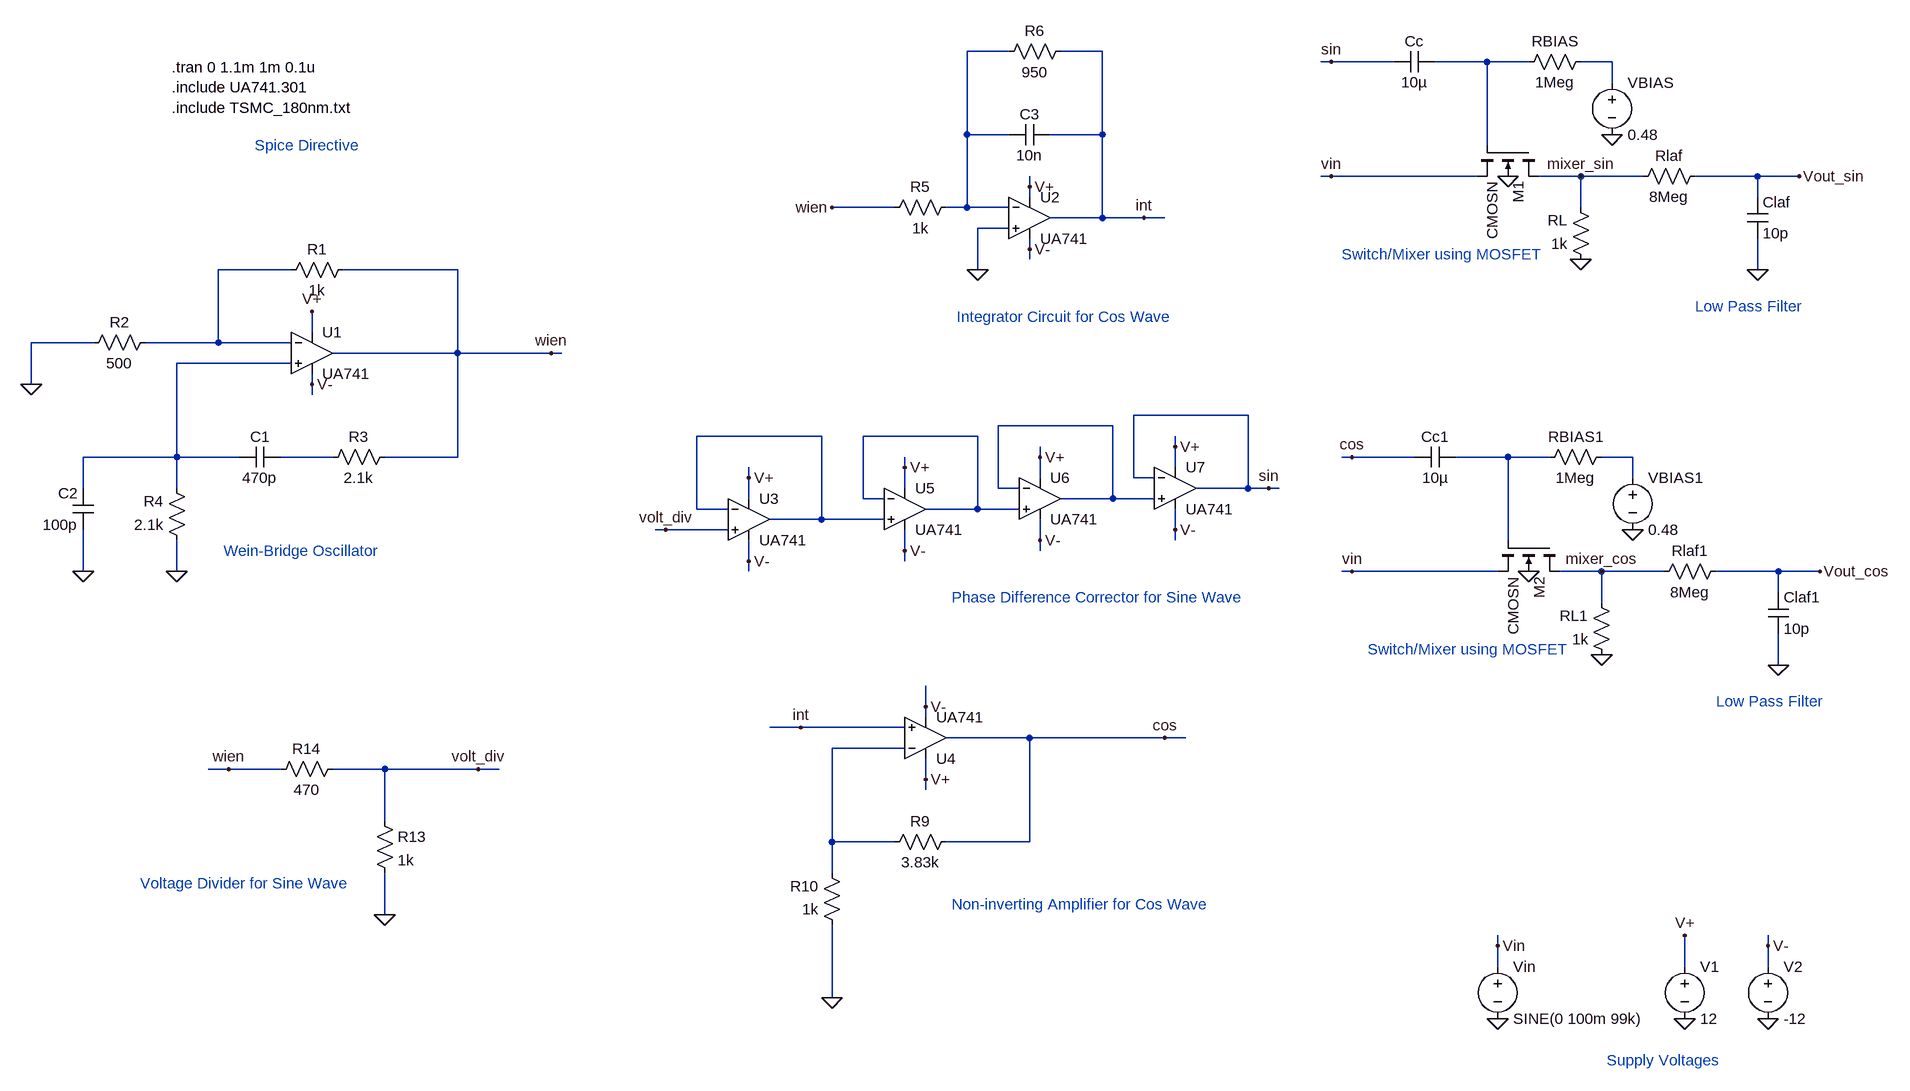
[diagram p0: schematic notfinal111.asc]
notfinal111.asc, the LTspice schematic file:
Version 4
SHEET 1 4804 1592
WIRE -400 -64 -464 -64
WIRE -256 -64 -320 -64
WIRE 96 -48 80 -48
WIRE 192 -48 96 -48
WIRE 336 -48 256 -48
WIRE 400 -48 336 -48
WIRE 528 -48 480 -48
WIRE 528 -16 528 -48
WIRE -464 64 -464 -64
WIRE -400 64 -464 64
WIRE -256 64 -256 -64
WIRE -256 64 -336 64
WIRE 336 80 336 -48
WIRE 96 128 80 128
WIRE 320 128 96 128
WIRE 480 128 416 128
WIRE 576 128 480 128
WIRE 752 128 656 128
WIRE 816 128 752 128
WIRE -368 144 -368 128
WIRE -368 160 -368 144
WIRE 752 160 752 128
WIRE -576 176 -672 176
WIRE -464 176 -464 64
WIRE -464 176 -496 176
WIRE -400 176 -464 176
WIRE 480 176 480 128
WIRE -256 192 -256 64
WIRE -256 192 -336 192
WIRE -192 192 -256 192
WIRE -160 192 -192 192
WIRE -400 208 -448 208
WIRE -368 240 -368 224
WIRE -368 256 -368 240
WIRE -1504 272 -1616 272
WIRE -1248 272 -1424 272
WIRE -448 272 -448 208
WIRE 752 272 752 224
WIRE -1472 368 -1472 336
WIRE -1808 384 -1904 384
WIRE -1616 384 -1616 272
WIRE -1616 384 -1728 384
WIRE -1504 384 -1616 384
WIRE -1248 400 -1248 272
WIRE -1248 400 -1440 400
WIRE -1104 400 -1248 400
WIRE -1088 400 -1104 400
WIRE -1504 416 -1680 416
WIRE -1904 448 -1904 384
WIRE -1472 448 -1472 432
WIRE -1472 464 -1472 448
WIRE -32 496 -208 496
WIRE -240 512 -416 512
WIRE -688 528 -880 528
WIRE -448 528 -624 528
WIRE -144 544 -144 528
WIRE -1680 560 -1680 416
WIRE -1680 560 -1824 560
WIRE -1584 560 -1680 560
WIRE -1440 560 -1520 560
WIRE -1248 560 -1248 400
WIRE -1248 560 -1360 560
WIRE -352 560 -352 544
WIRE 128 560 112 560
WIRE 224 560 128 560
WIRE 368 560 288 560
WIRE 432 560 368 560
WIRE 560 560 512 560
WIRE -560 576 -560 560
WIRE -144 576 -144 544
WIRE -800 592 -800 576
WIRE -352 592 -352 560
WIRE -208 592 -208 496
WIRE -176 592 -208 592
WIRE 560 592 560 560
WIRE -1824 608 -1824 560
WIRE -1680 608 -1680 560
WIRE -560 608 -560 576
WIRE -416 608 -416 512
WIRE -384 608 -416 608
WIRE -32 608 -32 496
WIRE -32 608 -112 608
WIRE 0 608 -32 608
WIRE 16 608 0 608
WIRE -800 624 -800 592
WIRE -624 624 -624 528
WIRE -592 624 -624 624
WIRE -240 624 -240 512
WIRE -240 624 -320 624
WIRE -176 624 -240 624
WIRE -880 640 -880 528
WIRE -832 640 -880 640
WIRE -448 640 -448 528
WIRE -448 640 -528 640
WIRE -384 640 -448 640
WIRE -688 656 -688 528
WIRE -688 656 -768 656
WIRE -592 656 -688 656
WIRE -928 672 -944 672
WIRE -832 672 -928 672
WIRE -144 672 -144 640
WIRE -352 688 -352 656
WIRE -144 688 -144 672
WIRE 368 688 368 560
WIRE -560 704 -560 672
WIRE -352 704 -352 688
WIRE -800 720 -800 688
WIRE -560 720 -560 704
WIRE -1824 736 -1824 672
WIRE -1680 736 -1680 688
WIRE -800 736 -800 720
WIRE 128 736 112 736
WIRE 352 736 128 736
WIRE 512 736 448 736
WIRE 608 736 512 736
WIRE 784 736 688 736
WIRE 848 736 784 736
WIRE 784 768 784 736
WIRE 512 784 512 736
WIRE 784 880 784 832
WIRE -528 944 -528 912
WIRE -528 960 -528 944
WIRE -720 976 -768 976
WIRE -560 976 -720 976
WIRE -368 992 -496 992
WIRE -160 992 -368 992
WIRE -128 992 -160 992
WIRE -560 1008 -672 1008
WIRE -1600 1040 -1632 1040
WIRE -1520 1040 -1600 1040
WIRE -1360 1040 -1440 1040
WIRE -1216 1040 -1360 1040
WIRE -1184 1040 -1216 1040
WIRE -528 1056 -528 1024
WIRE -528 1072 -528 1056
WIRE -1360 1120 -1360 1040
WIRE -672 1152 -672 1008
WIRE -576 1152 -672 1152
WIRE -368 1152 -368 992
WIRE -368 1152 -496 1152
WIRE -672 1200 -672 1152
WIRE -1360 1264 -1360 1200
WIRE 352 1312 352 1296
WIRE 768 1312 768 1296
WIRE 352 1344 352 1312
WIRE 640 1344 640 1296
WIRE 768 1344 768 1312
WIRE -672 1392 -672 1280
FLAG 528 64 0
FLAG 352 1424 0
FLAG 368 128 0
FLAG 480 256 0
FLAG 752 272 0
FLAG 816 128 Vout_sin
FLAG -1904 448 0
FLAG -1824 736 0
FLAG -1680 736 0
FLAG 768 1424 0
FLAG 640 1424 0
FLAG -1472 336 V+
FLAG -1472 448 V-
FLAG 640 1296 V+
FLAG 768 1312 V-
FLAG -1104 400 wien
FLAG -448 272 0
FLAG -672 176 wien
FLAG -368 144 V+
FLAG -368 240 V-
FLAG -192 192 int
FLAG 96 -48 sin
FLAG -672 1392 0
FLAG -720 976 int
FLAG -528 944 V-
FLAG -528 1056 V+
FLAG -1360 1264 0
FLAG -1600 1040 wien
FLAG -1216 1040 volt_div
FLAG -160 992 cos
FLAG 480 128 mixer_sin
FLAG -560 576 V+
FLAG -560 704 V-
FLAG -800 592 V+
FLAG -800 720 V-
FLAG -928 672 volt_div
FLAG -352 560 V+
FLAG -352 688 V-
FLAG -144 544 V+
FLAG -144 672 V-
FLAG 0 608 sin
FLAG 352 1312 Vin
FLAG 96 128 vin
FLAG 560 672 0
FLAG 400 736 0
FLAG 512 864 0
FLAG 784 880 0
FLAG 848 736 Vout_cos
FLAG 128 560 cos
FLAG 512 736 mixer_cos
FLAG 128 736 vin
SYMBOL voltage 528 -32 R0
SYMATTR InstName VBIAS
SYMATTR Value 0.48
SYMBOL voltage 352 1328 R0
SYMATTR InstName Vin
SYMATTR Value SINE(0 100m 99k)
SYMBOL nmos4 416 80 R90
SYMATTR InstName M1
SYMATTR Value2 l=0.18u w=0.4u ad=0.18p as=0.18p pd=1.7u ps=1.7u
SYMATTR Value CMOSN
SYMBOL res 496 -64 R90
WINDOW 0 0 56 VBottom 2
WINDOW 3 32 56 VTop 2
SYMATTR InstName RBIAS
SYMATTR Value 1Meg
SYMBOL res 496 272 R180
WINDOW 0 36 76 Left 2
WINDOW 3 36 40 Left 2
SYMATTR InstName RL
SYMATTR Value 1k
SYMBOL cap 256 -64 R90
WINDOW 0 0 32 VBottom 2
WINDOW 3 32 32 VTop 2
SYMATTR InstName Cc
SYMATTR Value 10µ
SYMBOL res 672 112 R90
WINDOW 0 0 56 VBottom 2
WINDOW 3 32 56 VTop 2
SYMATTR InstName Rlaf
SYMATTR Value 8Meg
SYMBOL cap 736 160 R0
SYMATTR InstName Claf
SYMATTR Value 10p
SYMBOL OpAmps/opamp2 -1472 336 R0
SYMATTR InstName U1
SYMATTR Value UA741
SYMBOL res -1408 256 R90
WINDOW 0 0 56 VBottom 2
WINDOW 3 32 56 VTop 2
SYMATTR InstName R1
SYMATTR Value 1k
SYMBOL res -1712 368 R90
WINDOW 0 0 56 VBottom 2
WINDOW 3 32 56 VTop 2
SYMATTR InstName R2
SYMATTR Value 500
SYMBOL res -1344 544 R90
WINDOW 0 0 56 VBottom 2
WINDOW 3 32 56 VTop 2
SYMATTR InstName R3
SYMATTR Value 2.1k
SYMBOL res -1664 704 R180
WINDOW 0 36 76 Left 2
WINDOW 3 36 40 Left 2
SYMATTR InstName R4
SYMATTR Value 2.1k
SYMBOL cap -1520 544 R90
WINDOW 0 0 32 VBottom 2
WINDOW 3 32 32 VTop 2
SYMATTR InstName C1
SYMATTR Value 470p
SYMBOL cap -1808 672 R180
WINDOW 0 24 56 Left 2
WINDOW 3 24 8 Left 2
SYMATTR InstName C2
SYMATTR Value 100p
SYMBOL voltage 640 1328 R0
SYMATTR InstName V1
SYMATTR Value 12
SYMBOL voltage 768 1328 R0
SYMATTR InstName V2
SYMATTR Value -12
SYMBOL OpAmps/opamp2 -368 128 R0
SYMATTR InstName U2
SYMATTR Value UA741
SYMBOL res -480 160 R90
WINDOW 0 0 56 VBottom 2
WINDOW 3 32 56 VTop 2
SYMATTR InstName R5
SYMATTR Value 1k
SYMBOL cap -336 48 R90
WINDOW 0 0 32 VBottom 2
WINDOW 3 32 32 VTop 2
SYMATTR InstName C3
SYMATTR Value 10n
SYMBOL res -304 -80 R90
WINDOW 0 0 56 VBottom 2
WINDOW 3 32 56 VTop 2
SYMATTR InstName R6
SYMATTR Value 950
SYMBOL OpAmps/opamp2 -528 1056 M180
SYMATTR InstName U4
SYMATTR Value UA741
SYMBOL res -480 1136 R90
WINDOW 0 0 56 VBottom 2
WINDOW 3 32 56 VTop 2
SYMATTR InstName R9
SYMATTR Value 3.83k
SYMBOL res -656 1296 R180
WINDOW 0 36 76 Left 2
WINDOW 3 36 40 Left 2
SYMATTR InstName R10
SYMATTR Value 1k
SYMBOL res -1376 1104 R0
SYMATTR InstName R13
SYMATTR Value 1k
SYMBOL res -1424 1024 R90
WINDOW 0 0 56 VBottom 2
WINDOW 3 32 56 VTop 2
SYMATTR InstName R14
SYMATTR Value 470
SYMBOL OpAmps/opamp2 -800 592 R0
SYMATTR InstName U3
SYMATTR Value UA741
SYMBOL OpAmps/opamp2 -560 576 R0
SYMATTR InstName U5
SYMATTR Value UA741
SYMBOL OpAmps/opamp2 -352 560 R0
SYMATTR InstName U6
SYMATTR Value UA741
SYMBOL OpAmps/opamp2 -144 544 R0
SYMATTR InstName U7
SYMATTR Value UA741
SYMBOL voltage 560 576 R0
SYMATTR InstName VBIAS1
SYMATTR Value 0.48
SYMBOL nmos4 448 688 R90
SYMATTR InstName M2
SYMATTR Value2 l=0.18u w=0.4u ad=0.18p as=0.18p pd=1.7u ps=1.7u
SYMATTR Value CMOSN
SYMBOL res 528 544 R90
WINDOW 0 0 56 VBottom 2
WINDOW 3 32 56 VTop 2
SYMATTR InstName RBIAS1
SYMATTR Value 1Meg
SYMBOL res 528 880 R180
WINDOW 0 36 76 Left 2
WINDOW 3 36 40 Left 2
SYMATTR InstName RL1
SYMATTR Value 1k
SYMBOL cap 288 544 R90
WINDOW 0 0 32 VBottom 2
WINDOW 3 32 32 VTop 2
SYMATTR InstName Cc1
SYMATTR Value 10µ
SYMBOL res 704 720 R90
WINDOW 0 0 56 VBottom 2
WINDOW 3 32 56 VTop 2
SYMATTR InstName Rlaf1
SYMATTR Value 8Meg
SYMBOL cap 768 768 R0
SYMATTR InstName Claf1
SYMATTR Value 10p
TEXT -1688 -40 Left 2 !.tran 0 1.1m 1m 0.1u\n.include UA741.301\n.include TSMC_180nm.txt
TEXT -1608 704 Left 2 ;Wein-Bridge Oscillator
TEXT -480 344 Left 2 ;Integrator Circuit for Cos Wave
TEXT -488 1248 Left 2 ;Non-inverting Amplifier for Cos Wave
TEXT 112 248 Left 2 ;Switch/Mixer using MOSFET
TEXT 656 328 Left 2 ;Low Pass Filter
TEXT 520 1488 Left 2 ;Supply Voltages
TEXT -1736 1216 Left 2 ;Voltage Divider for Sine Wave
TEXT -488 776 Left 2 ;Phase Difference Corrector for Sine Wave
TEXT 152 856 Left 2 ;Switch/Mixer using MOSFET
TEXT 688 936 Left 2 ;Low Pass Filter
TEXT -1560 80 Left 2 ;Spice Directive

The netlist it stands for:
* notfinal111.asc
VBIAS N003 0 0.48
Vin Vin 0 SINE(0 100m 99k)
M1 mixer_sin N002 Vin 0 CMOSN l=0.18u w=0.4u ad=0.18p as=0.18p pd=1.7u ps=1.7u
RBIAS N003 N002 1Meg
RL 0 mixer_sin 1k
Cc N002 sin 10µ
Rlaf Vout_sin mixer_sin 8Meg
Claf Vout_sin 0 10p
XU1 N005 N004 V+ V- wien UA741  ; pins In+ In- V+ V- OUT
R1 wien N004 1k
R2 N004 0 500
R3 wien N009 2.1k
R4 0 N005 2.1k
C1 N009 N005 470p
C2 0 N005 100p
V1 V+ 0 12
V2 V- 0 -12
XU2 0 N001 V+ V- int UA741  ; pins In+ In- V+ V- OUT
R5 N001 wien 1k
C3 int N001 10n
R6 int N001 950
XU4 int N012 V+ V- cos UA741  ; pins In+ In- V+ V- OUT
R9 cos N012 3.83k
R10 0 N012 1k
R13 volt_div 0 1k
R14 volt_div wien 470
XU3 volt_div N007 V+ V- N007 UA741  ; pins In+ In- V+ V- OUT
XU5 N007 N008 V+ V- N008 UA741  ; pins In+ In- V+ V- OUT
XU6 N008 N006 V+ V- N006 UA741  ; pins In+ In- V+ V- OUT
XU7 N006 sin V+ V- sin UA741  ; pins In+ In- V+ V- OUT
VBIAS1 N011 0 0.48
M2 mixer_cos N010 Vin 0 CMOSN l=0.18u w=0.4u ad=0.18p as=0.18p pd=1.7u ps=1.7u
RBIAS1 N011 N010 1Meg
RL1 0 mixer_cos 1k
Cc1 N010 cos 10µ
Rlaf1 Vout_cos mixer_cos 8Meg
Claf1 Vout_cos 0 10p
.model NMOS NMOS
.model PMOS PMOS
.lib standard.mos
.tran 0 1.1m 1m 0.1u
.include UA741.301
.include TSMC_180nm.txt
* Wein-Bridge Oscillator
* Integrator Circuit for Cos Wave
* Non-inverting Amplifier for Cos Wave
* Switch/Mixer using MOSFET
* Low Pass Filter
* Supply Voltages
* Voltage Divider for Sine Wave
* Phase Difference Corrector for Sine Wave
* Switch/Mixer using MOSFET
* Low Pass Filter
* Spice Directive
.backanno
.end